# Altium project MAS-CDCUnit.PrjPcb
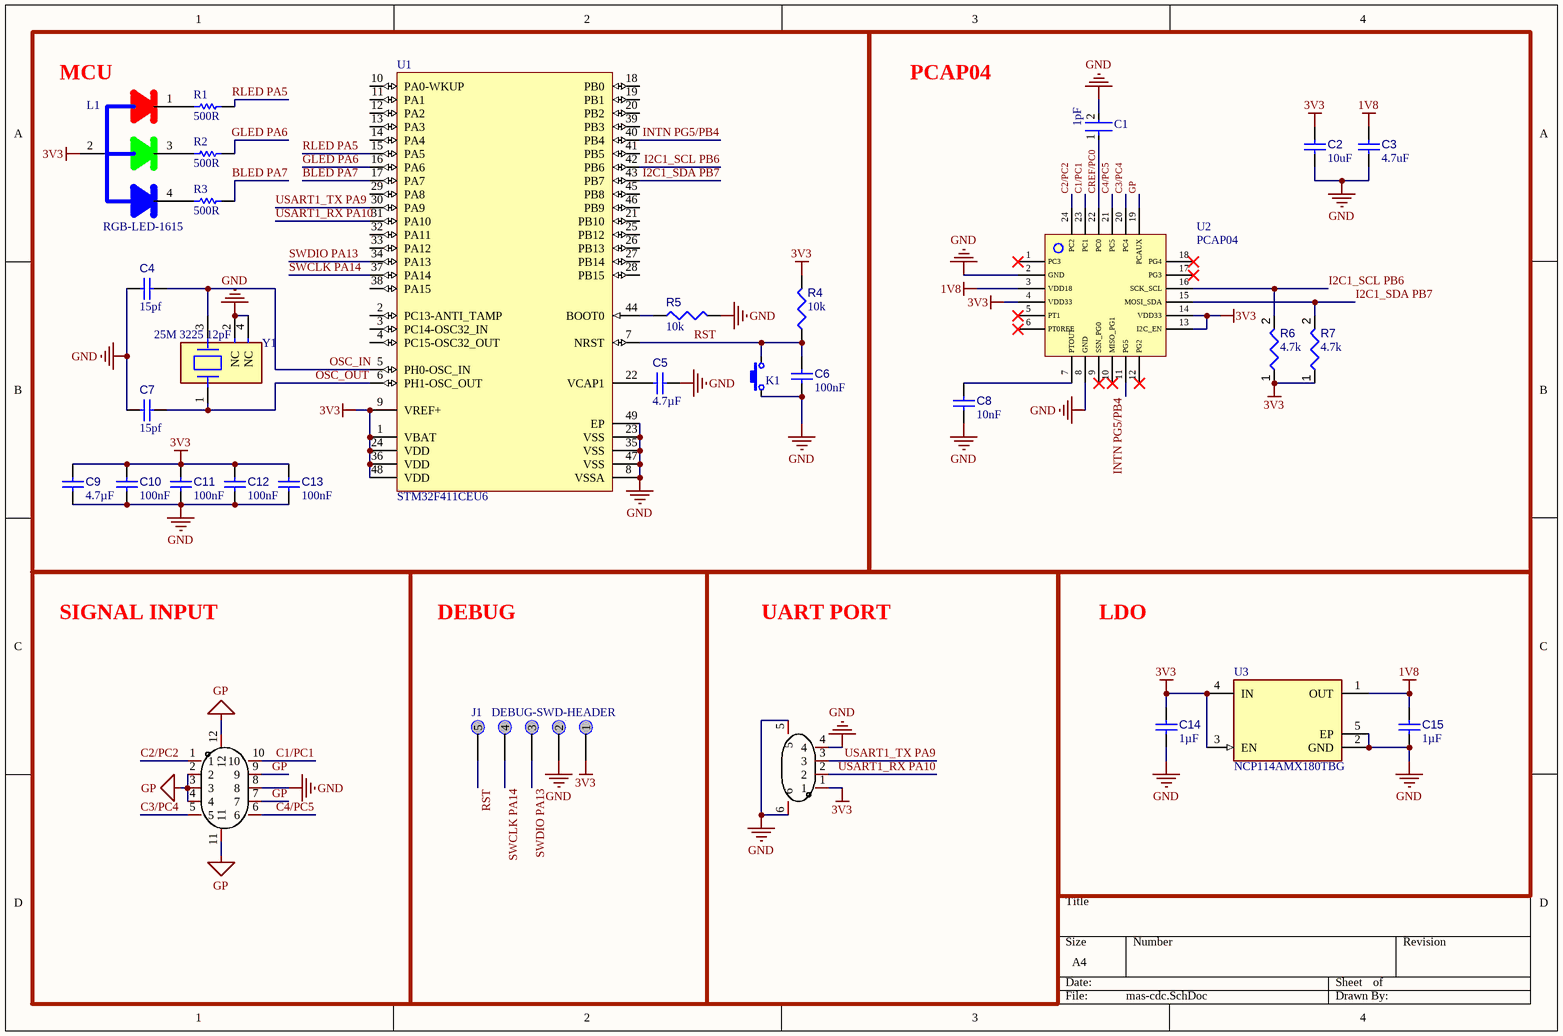
[diagram p0: mas-cdc.SchDoc]
1 sheet, 31 parts. Net scope: global (net labels, ports and power ports of the same name join across sheets).
Board file: mas-cdc.PcbDoc

## Sheet mas-cdc.SchDoc
size A4; SheetNumber: 1; SheetTotal: 2

### Parts
C1  1pF  [FP-GRM033-0_03-IPC_B]
C2  value 10uF  [CAPC0402(1005)60_L]  (hidden comment: Capacitor 10µF +/-40% 6.3V 0402)
C3  value 4.7uF  [CAPC0402(1005)60_L]  (hidden comment: Capacitor 10µF +/-40% 6.3V 0402)
C4  value 15pf  [CAPC0402(1005)60_L]  (hidden comment: Capacitor 100nF +/-20% 25V 0402)
C5  value 4.7µF  [CAPC0603(1608)100_L]  (hidden comment: Capacitor 4.7µF +/-20% 10V 0603)
C6  value 100nF  [CAPC0402(1005)60_L]  (hidden comment: Capacitor 100nF +/-20% 25V 0402)
C7  value 15pf  [CAPC0402(1005)60_L]  (hidden comment: Capacitor 100nF +/-20% 25V 0402)
C8  value 10nF  [CAPC0402(1005)60_L]  (hidden comment: Capacitor 10nF +/-20% 50V 0402)
C9  value 4.7µF  [CAPC0603(1608)100_L]  (hidden comment: Capacitor 4.7µF +/-20% 10V 0603)
C10  value 100nF  [CAPC0402(1005)60_L]  (hidden comment: Capacitor 100nF +/-20% 25V 0402)
C11  value 100nF  [CAPC0402(1005)60_L]  (hidden comment: Capacitor 100nF +/-20% 25V 0402)
C12  value 100nF  [CAPC0402(1005)60_L]  (hidden comment: Capacitor 100nF +/-20% 25V 0402)
C13  value 100nF  [CAPC0402(1005)60_L]  (hidden comment: Capacitor 100nF +/-20% 25V 0402)
C14  value 1µF  [CAPC0402(1005)60_L]  (hidden comment: Capacitor 1µF +/-20% 10V 0402)
C15  value 1µF  [CAPC0402(1005)60_L]  (hidden comment: Capacitor 1µF +/-20% 10V 0402)
CN1  SH1.0-4P  [CONN-SMD_4P-P1.00_WF10004-01200]  (value not drawn)
J1  DEBUG-SWD-HEADER  [DEBUG-SWD-HEADER-Footprint-1]
J2  BM24-10DS/2-0.35V(51)  [CONN-SMD_BM24-10DS-2-0.35V-51]  (value not drawn)
K1  Button  [SW-SMD_ST-1185X]  (value not drawn)
L1  RGB-LED-1615  [RGB-LED-1615-Footprint-1]
R1  500R  [RESC0603X26X15ML03T05]
R2  500R  [RESC0603X26X15ML03T05]
R3  500R  [RESC0603X26X15ML03T05]
R4  value 10k  [RESC0402(1005)_L]  (hidden comment: Resistor 10K  +/-1 % 0402 63 mW)
R5  value 10k  [RESC0402(1005)_L]  (hidden comment: Resistor 10K  +/-1 % 0402 63 mW)
R6  value 4.7k  [RESC0402(1005)_L]  (hidden comment: Resistor 4K7  +/-1 % 0402 63 mW)
R7  value 4.7k  [RESC0402(1005)_L]  (hidden comment: Resistor 4K7  +/-1 % 0402 63 mW)
U1  STM32F411CEU6  [STM-UFQFPN48_L]
U2  PCAP04  [QFN-24-PAD]
U3  NCP114AMX180TBG  [FP-517CU-MFG]
Y1  25M 3225 12pF  [FP-CX3225GB-MFG]

### Blocks framed on the sheet
MCU: C4-C7 C9-C13 K1 L1 R1-R5 U1 Y1
PCAP04: C1-C3 C8 R6 R7 U2
LDO: C14 C15 U3

### Nets
1V8: C3.2 C15.1 U2.3(VDD18) U3.1(OUT)
3V3: C2.2 C9.2 C10.2 C11.2 C12.2 C13.2 C14.1 CN1.1 J1.1 L1.2(COM+) R4.2 R6.1 R7.1 U1.1(VBAT) U1.9(VREF+) U1.24(VDD) U1.36(VDD) U1.48(VDD) U2.4(VDD33) U2.13(I2C_EN) U2.14(VDD33) U3.3(EN) U3.4(IN)
GND: C1.2 C2.1 C3.1 C4.2 C5.2 C6.1 C7.2 C8.1 C9.1 C10.1 C11.1 C12.1 C13.1 C14.2 C15.2 CN1.4 CN1.5 CN1.6 J1.2 J2.8 K1.1 R5.2 U1.8(VSSA) U1.23(VSS) U1.35(VSS) U1.47(VSS) U1.49(EP) U2.2(GND) U2.8(GND) U3.2(GND) U3.5(EP) Y1.2(NC) Y1.4(NC)
GP: J2.2 J2.3 J2.4 J2.7 J2.9 J2.11 J2.12 U2.19(PCAUX)
BLED PA7: R3.2 U1.17(PA7)
C1/PC1: J2.10 U2.23(PC1)
C2/PC2: J2.1 U2.24(PC2)
C3/PC4: J2.5 U2.20(PC4)
C4/PC5: J2.6 U2.21(PC5)
CREF/PC0: C1.1 U2.22(PC0)
GLED PA6: R2.2 U1.16(PA6)
I2C1_SCL PB6: R6.2 U1.42(PB6) U2.16(SCK_SCL)
I2C1_SDA PB7: R7.2 U1.43(PB7) U2.15(MOSI_SDA)
INTN PG5/PB4: U1.40(PB4) U2.11(PG5)
OSC_IN: C4.1 U1.5(PH0-OSC_IN) Y1.3(2_HOT)
OSC_OUT: C7.1 U1.6(PH1-OSC_OUT) Y1.1(1_HOT)
RLED PA5: R1.2 U1.15(PA5)
RST: C6.2 J1.5 K1.2 R4.1 U1.7(NRST)
SWCLK PA14: J1.4 U1.37(PA14)
SWDIO PA13: J1.3 U1.34(PA13)
USART1_RX PA10: CN1.2 U1.31(PA10)
USART1_TX PA9: CN1.3 U1.30(PA9)
NetC5_1: C5.1 U1.22(VCAP1)
NetC8_2: C8.2 U2.7(PTOUT)
NetL1_1: L1.1(R) R1.1
NetL1_3: L1.3(G) R2.1
NetL1_4: L1.4(B) R3.1
NetR5_1: R5.1 U1.44(BOOT0)

Not connected (* = marked no-connect by the designer): U1 2(PC13-ANTI_TAMP) 3(PC14-OSC32_IN) 4(PC15-OSC32_OUT) 10(PA0-WKUP) 11(PA1) 12(PA2) 13(PA3) 14(PA4) 18(PB0) 19(PB1) 20(PB2) 21(PB10) 25(PB12) 26(PB13) 27(PB14) 28(PB15) 29(PA8) 32(PA11) 33(PA12) 38(PA15) 39(PB3) 41(PB5) 45(PB8) 46(PB9); U2 1(PC3)* 5(PT1)* 6(PT0REF)* 9(SSN_PG0)* 10(MISO_PG1)* 12(PG2)* 17(PG3)* 18(PG4)*

### Notes on the sheet
- SIGNAL INPUT
- DEBUG
- UART PORT

### Library data of the parts
C1 = CMP-06035-061146-1: Chip Multilayer Ceramic Capacitors for General Purpose, 0201, 1.0pF, C0G, 30ppm/°C, 0.05pF, 50V; Dielectric: C0G; Package Quantity: 15000; Max Operating Temperature: 125°C; Length: 0.6mm; Width: 0.3mm; Height: 0.3mm; Weight: 1.2E-05oz; Case/Package: 0201; Packaging: Tape and Reel; Termination: SMD/SMT; Thickness: 300um; Voltage Rating (DC): 50V; Min Operating Temperature: -55°C; Case Code (Imperial): 0201; Capacitance: 1pF; Case Code (Metric): 0603
C2 C3 = CMP-001-00074-3: Chip Capacitor, 10µF +/-40%, 6.3V, 0402, Thickness 0.6 mm; Tolerance: 10%; Case/Package: 0402; Pins: 2; Mounting Technology: SMT; Voltage Rating: 6.3V; Max Operating Temperature: 85°C; Min Operating Temperature: -55°C
C4 C6 C7 C10-C13 = CMP-001-00065-4: Chip Capacitor, 100nF +/-20%, 25V, 0402, Thickness 0.6 mm; Tolerance: 10%; Max Operating Temperature: 85°C; Min Operating Temperature: -55°C; Pins: 2; Voltage Rating: 25V; Mounting Technology: SMT; Case/Package: 0402
C5 C9 = CMP-001-00076-4: Chip Capacitor, 4.7µF +/-20%, 10V, 0603, Thickness 1 mm; Tolerance: 10%; Mounting Technology: SMT; Case/Package: 0603; Pins: 2; Min Operating Temperature: -55°C; Max Operating Temperature: 85°C; Voltage Rating: 10V
C8 = CMP-001-00069-3: Chip Capacitor, 10nF +/-20%, 50V, 0402, Thickness 0.6 mm; Tolerance: 5%; Max Operating Temperature: 85°C; Pins: 2; Case/Package: 0402; Voltage Rating: 50V; Min Operating Temperature: -55°C; Mounting Technology: SMT
C14 C15 = CMP-001-00063-3: Chip Capacitor, 1µF +/-20%, 10V, 0402, Thickness 0.6 mm; Tolerance: 10%; Mounting Technology: SMT; Max Operating Temperature: 85°C; Voltage Rating: 10V; Pins: 2; Case/Package: 0402; Min Operating Temperature: -55°C
CN1 = SH1.0-4P: 连接器; Manufacturer: ATOM(爱特姆); Name: WF10004-01200; Add into BOM: yes; Pitch: 1mm; Pins Structure: 1x4P; Number of PINs Per Row: 4; Gender: 公型插针; Current Rating (Max): 500mA; Symbol: WF10004-01200; Device: WF10004-01200; LCSC Part Name: 1mm 1x4P 卧贴; Supplier Part: C479990; Manufacturer Part: WF10004-01200; Supplier Footprint: SMD,P=1mm; JLCPCB Part Class: Extended Part; Datasheet: https://atta.szlcsc.com/upload/public/pdf/source/20200107/C479990_7EE1728C707014A64676B41D860FB4D7.pdf; Supplier: LCSC; Convert to PCB: yes; Reference Series: -; Number of Rows: 1; Row Spacing: -; Mounting Style: 卧贴; Operating Temperature Range: -25℃~+85℃
J1 = CMP-002-00074-1: 1.27MM 5P 测试/调试/下载焊点
J2 = BM24-10DS/2-0.35V(51): 板对板连接器; Manufacturer: HRS(广濑); Add into BOM: yes; Pitch: 0.35mm; Gender: 母; Current Rating (Max): 5A; Name: BM24-10DS/2-0.35V(51); Symbol: BM24-10DS/2-0.35V(51); Device: BM24-10DS/2-0.35V(51); LCSC Part Name: PIN：10P 间距0.35mm 母 立贴; Supplier Part: C424555; Manufacturer Part: BM24-10DS/2-0.35V(51); Supplier Footprint: SMD,P=0.35mm; JLCPCB Part Class: Extended Part; Datasheet: https://atta.szlcsc.com/upload/public/pdf/source/20190903/C424561_940D938A8801F9E5E7B99C1FFBE5CEB4.pdf; Supplier: LCSC; Convert to PCB: yes; Number of Pins: 10P; Number of Rows: 2; Mounting Style: 立贴; Contact Plating: 金; Operating Temperature Range: -40℃~+85℃
L1 = CMP-007-00036-2: RGB LED
R1-R3 = CMP-2004-01563-1: Part Number: RK73H1HTTC1002F; Manufacturer: KOA Speer
R4 R5 = CMP-009-00149-3: Chip Resistor, 10 kOhms, +/-1 %, 63 mW, -55 to 125 degC, 0402; Power: 63mW; Tolerance: 1%; Min Operating Temperature: -55°C; Case/Package: 0402; Max Operating Temperature: 155°C; Pins: 2
R6 R7 = CMP-009-00158-3: Chip Resistor, 4,7 kOhms, +/-1 %, 63 mW, -55 to 155 degC, 0402; Power: 63mW; Tolerance: 1%; Max Operating Temperature: 155°C; Pins: 2; Min Operating Temperature: -55°C; Case/Package: 0402
U1 = STM32F411CEU6-2: ARM Cortex-M4 32-bit MCU+FPU, 512 KB Flash, 128 KB RAM, 36 I/Os, 48-Pin UFQFPN, -40 to 85 degC, Tray; Operating Frequency(F) (Processor speed) (MHz): 100; FLASH Size (Prog) (kB): 512; Internal RAM Size (kB): 128; I/Os (High Current): 36; Supply Voltage(Vcc) min (V): 1.7; Package Reference: 48-Pin Ultra Thin Fine Pitch Quad Flat No-Lead, 7 x 7 x 0.6 mm Body, 0.5 mm Pitch, Exposed Pad; ComponentLink1Description: Manufacturer URL; ComponentLink1URL: http://www.st.com/; Packing: Tray; Package Description: UFQFPN48; Core: ARM Cortex-M4; ComponentLink2Description: Datasheet; ComponentLink2URL: http://www.st.com/st-web-ui/static/active/en/resource/technical/document/datasheet/DM00115249.pdf; DatasheetVersion: Rev. 6; Mounting Technology: Surface Mount
U2 = PCAP04: CDC IC
U3 = CMP-07128-000020-1: IC REG LINEAR 1.8V 300MA 4UDFN; Manufacturer: ON Semiconductor; Output Type: Fixed; Min Supply Voltage: 2.8V; Standoff Height: 0mm; Nominal Supply Current: 50uA; Max Supply Voltage: 5.5V; Max Junction Temp: +150°C; Dropout Voltage: 245mV; Accuracy Percentage: 1%; Number Of Outputs: 1; Output Current: 300mA; Device Class L1: Integrated Circuits (ICs); Device Class L3: Voltage Regulators - Linear; Output Voltage: 1.8V; Category: IC; ComponentLink2URL: https://www.onsemi.com/pub/Collateral/NCP114-D.PDF; Temperature Range High: +150°C; Manufacturer Part Number: NCP114AMX180TBG; Temperature: to +150°C; Footprint Url: https://www.onsemi.com/pub/Collateral/517CU.PDF; Mouser Description: LDO Voltage Regulators 300 MA CMOS LDO AD O; RoHS: TRUE; Lead Free: Yes; Device Class L2: Power Management ICs; ComponentLink2Description: Datasheet; Automotive: No; Package: 517CU; Octopart: https://octopart.com/ncp114amx180tbg-on+semiconductor-56808172; Digikey Description: IC REG LINEAR 1.8V 300MA 4UDFN; Height: 0.6mm
Y1 = CMP-20727-000007-1: CRYSTAL 16.0000MHZ 8PF SMD; Tolerance: 20ppm; Frequency: 16MHz; Series Resistance: 80R; Frequency Stability: 30ppm; Width: 0.098inch; RoHS Compliant: Yes; Package Quantity: 3000; Weight: 0.000564oz; Length: 0.126inch; Max Operating Temperature: 85°C; Case/Package: SMD/SMT; Lead Free: Lead Free; Packaging: Tape and Reel; Min Operating Temperature: -40°C; Load Capacitance: 8pF; ESR (Equivalent Series Resistance): 80R; Mount: Surface Mount; Termination: SMD/SMT; Frequency Tolerance: 20ppm; Height: 0.035inch